# Altium schematic sheet bbr18_wheel_motor_connector_board.SchDoc
size A4
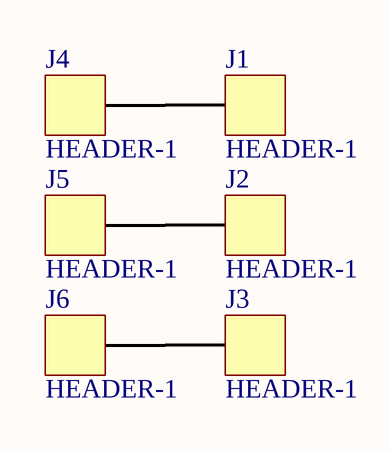
[diagram p0: bbr18_wheel_motor_connector_board.SchDoc]

## Parts
J1  HEADER-1  [2MM-BULLET-PLUG-VIA]
J2  HEADER-1  [2MM-BULLET-PLUG-VIA]
J3  HEADER-1  [2MM-BULLET-PLUG-VIA]
J4  HEADER-1  [POWER-PAD-4x3]
J5  HEADER-1  [POWER-PAD-4x3]
J6  HEADER-1  [POWER-PAD-4x3]

## Nets
NetJ1_1: J1.1 J4.1
NetJ2_1: J2.1 J5.1
NetJ3_1: J3.1 J6.1